# Altium schematic sheet mcu.SchDoc
size A4; SheetNumber: 2; SheetTotal: 4
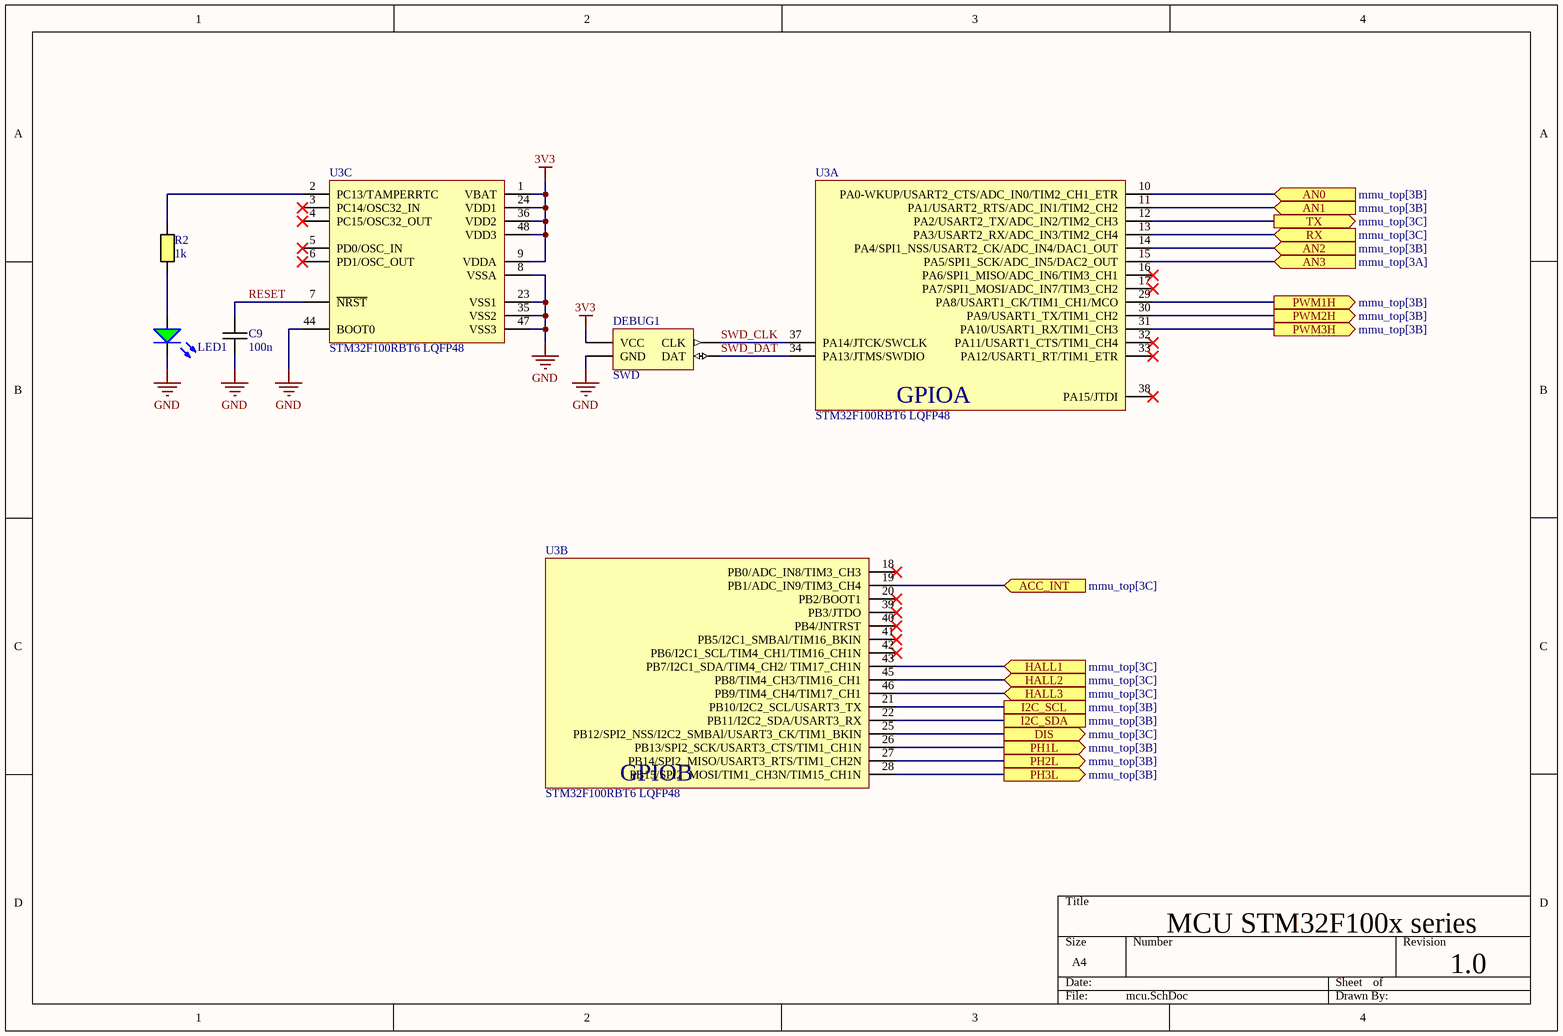
[diagram p0: mcu.SchDoc]

## Parts
C9  100n  [CAPC0603(1608)55_N]
DEBUG1  SWD  [PIN HEADER SINGLE 4]
LED1  1206 LED GREEN  [1206 LED GREEN]  (value not drawn)
R2  1k  [RESC0603(1608)_N]
U3  STM32F100RBT6 LQFP48  [LQFP48]  (parts A,B,C of 3)

## Ports
ACC_INT (in, see mmu_top[3C]), AN0 (in, see mmu_top[3B]), AN1 (in, see mmu_top[3B]), AN2 (in, see mmu_top[3B]), AN3 (in, see mmu_top[3A]), DIS (out, see mmu_top[3C]), HALL1 (in, see mmu_top[3C]), HALL2 (in, see mmu_top[3C]), HALL3 (in, see mmu_top[3C]), I2C_SCL (see mmu_top[3B]), I2C_SDA (see mmu_top[3B]), PH1L (out, see mmu_top[3B]), PH2L (out, see mmu_top[3B]), PH3L (out, see mmu_top[3B]), PWM1H (out, see mmu_top[3B]), PWM2H (out, see mmu_top[3B]), PWM3H (out, see mmu_top[3B]), RX (in, see mmu_top[3C]), TX (out, see mmu_top[3C])

## Nets
3V3: DEBUG1.1(VCC) U3.1(VBAT) U3.9(VDDA) U3.24(VDD1) U3.36(VDD2) U3.48(VDD3)
GND: C9.2 DEBUG1.3(GND) LED1.K U3.8(VSSA) U3.23(VSS1) U3.35(VSS2) U3.44(BOOT0) U3.47(VSS3)
ACC_INT: U3.19(PB1/ADC_IN9/TIM3_CH4) ; port ACC_INT
AN0: U3.10(PA0-WKUP/USART2_CTS/ADC_IN0/TIM2_CH1_ETR) ; port AN0
AN1: U3.11(PA1/USART2_RTS/ADC_IN1/TIM2_CH2) ; port AN1
AN2: U3.14(PA4/SPI1_NSS/USART2_CK/ADC_IN4/DAC1_OUT) ; port AN2
AN3: U3.15(PA5/SPI1_SCK/ADC_IN5/DAC2_OUT) ; port AN3
DIS: U3.25(PB12/SPI2_NSS/I2C2_SMBAl/USART3_CK/TIM1_BKIN) ; port DIS
HALL1: U3.43(PB7/I2C1_SDA/TIM4_CH2/_TIM17_CH1N) ; port HALL1
HALL2: U3.45(PB8/TIM4_CH3/TIM16_CH1) ; port HALL2
HALL3: U3.46(PB9/TIM4_CH4/TIM17_CH1) ; port HALL3
I2C_SCL: U3.21(PB10/I2C2_SCL/USART3_TX) ; port I2C_SCL
I2C_SDA: U3.22(PB11/I2C2_SDA/USART3_RX) ; port I2C_SDA
PH1L: U3.26(PB13/SPI2_SCK/USART3_CTS/TIM1_CH1N) ; port PH1L
PH2L: U3.27(PB14/SPI2_MISO/USART3_RTS/TIM1_CH2N) ; port PH2L
PH3L: U3.28(PB15/SPI2_MOSI/TIM1_CH3N/TIM15_CH1N) ; port PH3L
PWM1H: U3.29(PA8/USART1_CK/TIM1_CH1/MCO) ; port PWM1H
PWM2H: U3.30(PA9/USART1_TX/TIM1_CH2) ; port PWM2H
PWM3H: U3.31(PA10/USART1_RX/TIM1_CH3) ; port PWM3H
RESET: C9.1 U3.7(~{NRST})
RX: U3.13(PA3/USART2_RX/ADC_IN3/TIM2_CH4) ; port RX
SWD_CLK: DEBUG1.2(CLK) U3.37(PA14/JTCK/SWCLK)
SWD_DAT: DEBUG1.4(DAT) U3.34(PA13/JTMS/SWDIO)
TX: U3.12(PA2/USART2_TX/ADC_IN2/TIM2_CH3) ; port TX
NetLED1_A: LED1.A R2.1
NetR2_2: R2.2 U3.2(PC13/TAMPERRTC)

Not connected (* = marked no-connect by the designer): U3 3(PC14/OSC32_IN)* 4(PC15/OSC32_OUT)* 5(PD0/OSC_IN)* 6(PD1/OSC_OUT)* 16(PA6/SPI1_MISO/ADC_IN6/TIM3_CH1)* 17(PA7/SPI1_MOSI/ADC_IN7/TIM3_CH2)* 18(PB0/ADC_IN8/TIM3_CH3)* 20(PB2/BOOT1)* 32(PA11/USART1_CTS/TIM1_CH4)* 33(PA12/USART1_RT/TIM1_ETR)* 38(PA15/JTDI)* 39(PB3/JTDO)* 40(PB4/JNTRST)* 41(PB5/I2C1_SMBAl/TIM16_BKIN)* 42(PB6/I2C1_SCL/TIM4_CH1/TIM16_CH1N)*

## Notes on the sheet
- MCU STM32F100x series
- 1.0
- (in symbol STM32F100RBT6 LQFP48, part A) GPIOA
- (in symbol STM32F100RBT6 LQFP48, part B) GPIOB

## Library data of the parts
C9 = Capacitor M: Ceramic capacitor Medium density; Value: 100n
DEBUG1 = SWD DEBUG: SWD ST DEBUG
R2 = Resistor M: Resistor Medium Density; Value: 1k